# EAGLE design tritiled_v31_xpe (EAGLE 8.5.0)
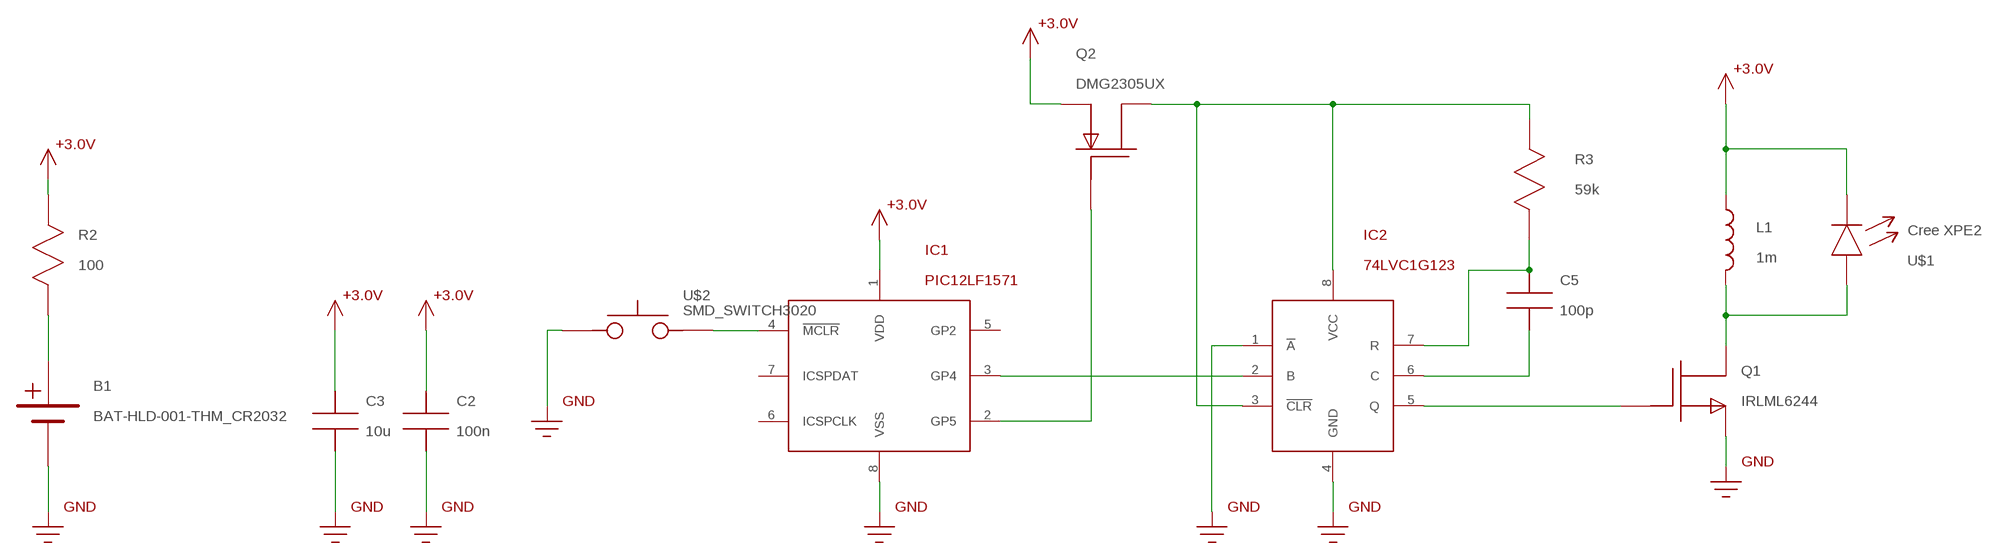
[diagram p0: schematic, sheet 1]

## Parts
B1  BAT-HLD-001-THM_CR2032  [CR2032_BAT-HLD-001-THM]
C2  100n  C0805  [0805]
C3  10u  C1206  [1206]
C5  100p  C0603  [C0603]
IC1  PIC12LF1571  [SOIC8]
IC2  74LVC1G123  [SM8]
L1  1m  SRR6028_INDUCTOR  [SRR6028_INDUCTOR]
Q1  IRLML6244  ZXMN3B01FSOT23  [SOT-23]
Q2  DMG2305UX  DMG2305UXSOT23  [SOT-23]
R2  100  R1206  [R1206]
R3  59k  R0603  [R0603]
U$1  Cree XPE2  LEDCREE_XPE  [CREE_XPE_LED]
U$2  SMD_SWITCH3020  [SWITCH_3020]

## Nets
+3.6V: C2.P$1 C3.P$1 IC1.1(VDD) L1.P$1 Q2.2(S) R2.P$1 U$1.C ; supply symbol labelled +3.0V
GND: B1.GND(0V) C2.P$2 C3.P$2 IC1.8(VSS) IC2.1(!A!) IC2.4(GND) Q1.2(S) U$2.A
N$1: C5.P$1 IC2.7(R) R3.P$1
N$2: IC2.5(Q) Q1.1(G)
N$3: IC1.2(GP5) Q2.1(G)
N$4: IC1.3(GP4) IC2.2(B)
N$5: C5.P$2 IC2.6(C)
N$6: IC1.4(!MCLR!) U$2.B
N$7: IC2.3(!CLR!) IC2.8(VCC) Q2.3(D) R3.P$2
N$9: B1.+V@1(+V) B1.+V@2(+V) B1.+V@3(+V) B1.+V@4(+V) R2.P$2
N$10: L1.P$2 Q1.3(D) U$1.A
Unconnected: IC1.5(GP2) IC1.6(ICSPCLK) IC1.7(ICSPDAT)

## Library data of the parts
B1 = tritiled:BAT-HLD-001-THM_CR2032
C2 C3 C5 = tritiled:C
IC1 = tritiled:PIC12LF1571
IC2 = tritiled:74LVC1G123
L1 = tritiled:SRR6028_INDUCTOR
Q1 = tritiled:ZXMN3B01F
Q2 = tritiled:DMG2305UX
R2 R3 = tritiled:R
U$1 = tritiled:LED
U$2 = tritiled:SMD_SWITCH

## Board
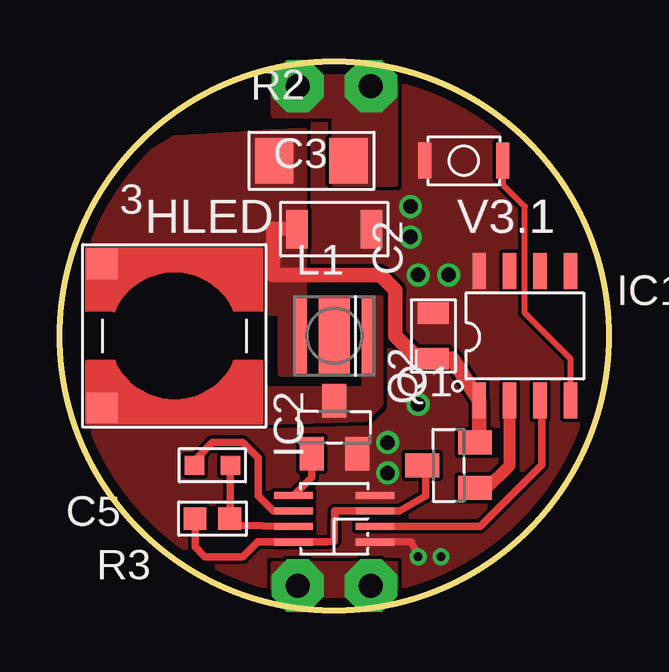
[diagram p1: board, top side]
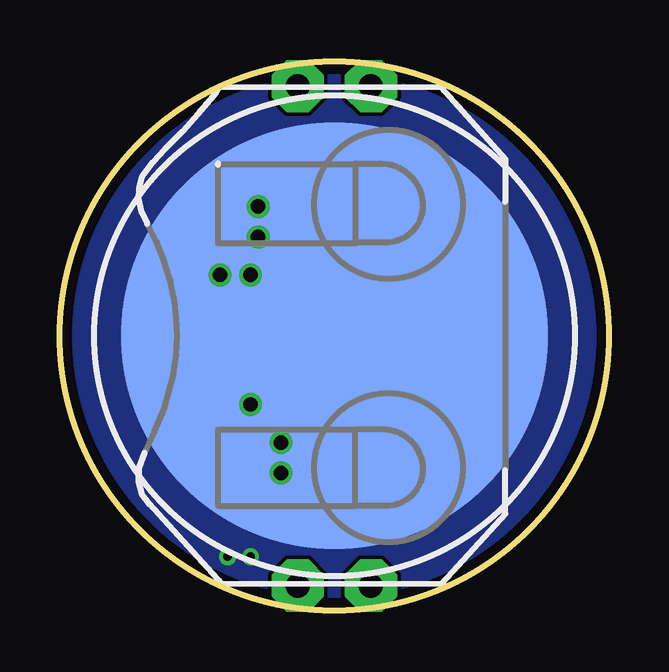
[diagram p2: board, bottom side, seen from below]

Size 22.86 x 22.86 mm. Coordinates in mm from the lower left corner, seen from the top.
Outline: circle at 11.43,11.43 radius 11.43
Copper layers (1*16): Top 0.0356mm / dielectric 1.5011mm / Bottom 0.0356mm
Design rules "LaenPCBOrder": minimum track width 6mil, minimum drill 13mil, track to track 6mil, track to pad 6mil, pad to pad 6mil, via to via 6mil, smd to smd 6mil, copper to edge 15mil, drill to drill 6mil, minimum pad ring 7mil, minimum via ring 7mil, stop-mask expansion 3mil, vias tented up to drill 0mil, thermal gap 10mil

### Footprints (pad centres in the part's own frame; a part is rotated, then mirrored left to right if it is on the bottom)
CR2032_BAT-HLD-001-THM = drill 1 pad 2.184 octagon: +V@1 -10.414,1.524; +V@2 -10.414,-1.524; +V@3 10.414,-1.524; +V@4 10.414,1.524 | smd 17.78 x 17.78: GND 0,0
0805 = smd 0.9 x 1.3: P$1 -0.95,0; P$2 0.95,0
1206 = smd 0.9 x 1.6: P$1 -1.55,0; P$2 1.55,0
C0603 = smd 0.8 x 0.8: P$1 -0.75,0; P$2 0.75,0
SOIC8 = smd 0.55 x 1.5: 1 -1.905,-2.7; 2 -0.635,-2.7; 3 0.635,-2.7; 4 1.905,-2.7; 5 1.905,2.7; 6 0.635,2.7; 7 -0.635,2.7; 8 -1.905,2.7
SM8 = smd 0.3 x 1.6: 1 -0.975,-1.7; 2 -0.325,-1.7; 3 0.325,-1.7; 4 0.975,-1.7; 5 0.975,1.7; 6 0.325,1.7; 7 -0.325,1.7; 8 -0.975,1.7
SRR6028_INDUCTOR = smd 1.27 x 1.27: P$1 -3,3; P$2 -3,-3
SOT-23 = smd 1 x 1.4: 1 -0.95,-1.1; 2 0.95,-1.1; 3 0,1.1
R1206 = smd 1.6 x 1.9: P$1 -1.55,0; P$2 1.55,0
R0603 = smd 0.95 x 0.95: P$1 -0.725,0; P$2 0.725,0
CREE_XPE_LED = smd 0.5 x 3.3: A -1.4,0; C 1.4,0 | smd 1.3 x 3.3: HS 0,0
SWITCH_3020 = smd 0.55 x 1.5: A -1.625,0; B 1.625,0

### Placement (x,y rotation side)
B1  11.43,11.43 270 bottom
C2  15.56,11.43 90 top
C3  11.43,15.88 0 top
C5  6.35,6.03 180 top
IC1  19.37,11.43 0 top
IC2  11.43,3.81 90 top
L1  4.76,11.43 0 top
Q1  11.43,7.62 0 top
Q2  16.19,6.03 90 top
R2  10.48,18.73 0 top
R3  6.35,3.81 180 top
U$1  11.43,11.43 180 top
U$2  16.83,18.73 0 top

### Tracks (layer width: path | path; a pad name or v marks a point on that pad's centre or on a via)
+3.6V
  Top 0.61: C3.P$1 8.89,15.91 8.89,13.97 13.34,13.97 13.97,13.34 13.97,11.43 14.92,10.48 C2.P$1 16.35,10.48 IC1.1 17.46,7.15 Q2.2
  pour Top (no thermals): 10.16,20 10.16,9.84 9.21,9.84 9.21,12.38 7.3,12.38 4.45,13.97 3.17,14.61 1.27,14.61 1.59,16.19 3.17,18.73 4.76,19.68
GND  (via drill 0.35, 0.6)
  Top 0.305: IC2.1 14.63,2.83 v14.92,2.22
  other vias: 14.92,13.97 16.19,13.97 13.65,6.99 13.65,5.71 14.61,16.83 14.61,15.56 14.92,8.57 15.88,2.22
  pour Top (rank 2, no thermals): 0,0 0,23.18 23.18,22.86 23.18,-0.32
  pour Bottom (no thermals): 0,0 0,23.18 23.18,22.86 23.18,-0.32
N$1
  Top 0.305: IC2.7 7.15,3.52 7.04,3.84 R3.P$1 | R3.P$1 | R3.P$1 7.1,3.83 C5.P$1
N$2
  Top 0.305: IC2.5 10.48,5.54 Q1.1
N$3
  Top 0.508: Q2.1 17.78,5.08 18.73,6.03 IC1.2
N$4
  Top 0.305: IC2.2 14.82,3.48 15.45,3.49 17.51,3.49 20.08,6.05 20.08,8.33 20,8.57 IC1.3
N$5
  Top 0.305: IC2.6 8.88,4.13 8.26,4.76 8.26,6.35 7.62,6.99 6.35,6.99 5.71,6.35 5.71,5.83 C5.P$2
N$6
  Top 0.254: IC1.4 21.27,10.48 19.37,12.38 19.37,16.83 18.47,17.72 18.47,18.04 U$2.B
N$7
  Top 0.305: R3.P$2 5.62,2.63 6.03,2.22 7.62,2.22 8.23,2.83 IC2.8 11.13,2.83 11.43,2.86 11.43,3.49 11.44,4.13 IC2.3 14.15,4.13 15.24,4.76 15.24,5.88 Q2.3
N$9
  pour Top (no thermals): 8.89,22.54 8.89,20.64 11.43,20.64 11.43,17.78 13.97,17.78 13.97,22.54
  pour Top (no thermals): 8.89,1.91 8.89,0.32 13.97,0.32 13.97,1.91
N$10
  pour Top (no thermals): 12.7,13.02 13.34,13.02 13.34,8.57 12.7,7.94 1.27,7.62 1.27,8.26 6.35,8.26 6.99,9.21 12.7,9.21

### Text on the board
tPlace: 3 | HLED | V3.1